# EAGLE design TPS54302 (EAGLE 9.5.1)
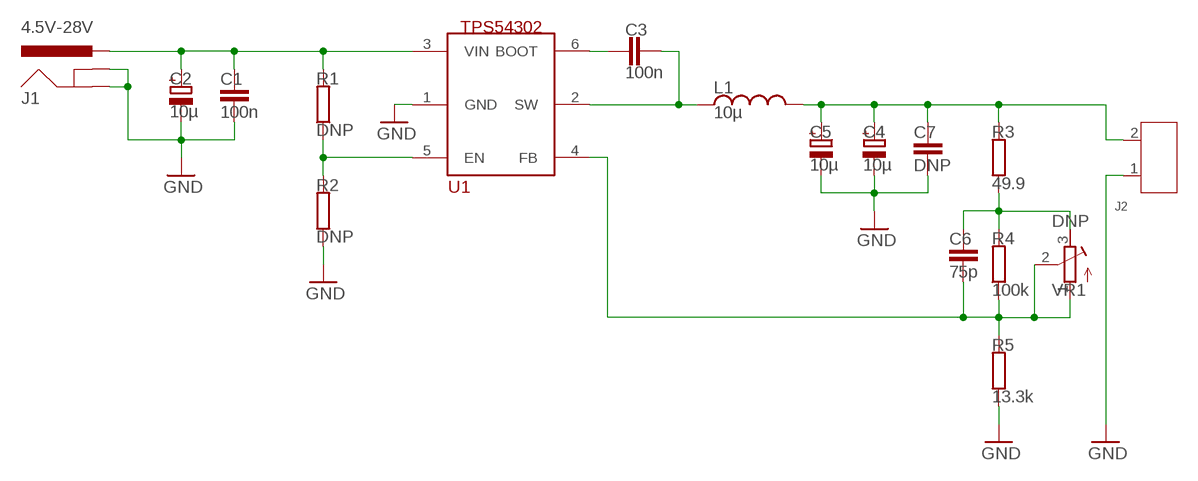
[diagram p0: schematic, sheet 1]

## Parts
C1  100n  C-EUC0603K  [C0603K]
C2  10µ  CPOL-EU153CLV-0605  [153CLV-0605]
C3  100n  C-EUC0603K  [C0603K]
C4  10µ  CPOL-EU153CLV-0605  [153CLV-0605]
C5  10µ  CPOL-EU153CLV-0605  [153CLV-0605]
C6  75p  C-EUC0603K  [C0603K]
C7  DNP  C-EUC0603K  [C0603K]
J1  4.5V-28V  POWER_JACKPTH_SMD_COMBO  [POWER_JACK_COMBO]
J2  SCREW-TERMINAL-GREEN(2P-5.0)  [H2-5.0-10.5X8.0MM]
L1  10µ  INDUCTOR8080  [INDDFN800X800X420-2N]
R1  DNP  R-EU_R0603  [R0603]
R2  DNP  R-EU_R0603  [R0603]
R3  49.9  R-EU_R0603  [R0603]
R4  100k  R-EU_R0603  [R0603]
R5  13.3k  R-EU_R0603  [R0603]
U1  TPS54302  [SOT95P280X110-6N]
VR1  DNP  R-TRIMM64W  [RTRIM64W]

## Nets
BOOT: C3.1 U1.6(BOOT)
EN: R1.1 R2.2 U1.5(EN)
FB: C6.1 R4.1 R5.2 U1.4(FB) VR1.1(A) VR1.2(S)
GND: C1.2 C2.- C4.- C5.- C7.2 J1.GND(GNDBREAK) J1.GND@1(GND) J1.GND@3(GND) J1.GND@4(GND) J2.1 R2.1 R5.1 U1.1(GND)
N$5: C6.2 R3.1 R4.2 VR1.3(E)
SW: C3.2 L1.1 U1.2(SW)
VIN: C1.1 C2.+ J1.POWER(PWR) J1.POWER@1(PWR) J1.POWER@2(PWR) R1.2 U1.3(VIN)
VOUT: C4.+ C5.+ C7.1 J2.2 L1.2 R3.2

## Library data of the parts
C1 C3 C6 C7 = rcl:C-EU: CAPACITOR, European symbol; SPICEPREFIX: C
C2 C4 C5 = rcl:CPOL-EU: POLARIZED CAPACITOR, European symbol; SPICEPREFIX: C
J1 = DC-Converters:POWER_JACK: Power Jack Connector This is the standard 5.5mm barrel jack for power. The PTH is the most common, proven, reliable, footprint. The Slot footprint only works if the mill layer is transmitted to the PCB fab house so be warned. Here are the connectors we sell at SparkFun: DC Barrel Power Jack/Connector <https://www.sparkfun.com/products/119> (PRT-00119) DC Barrel Power Jack/Connector (SMD) <https://www.sparkfun.com/products/12748> (PRT-12748) DC Barrel Jack Adapter - Breadboard Compatible <https://www.sparkfun.com/products/10811> (PRT-10811) It is used on this SparkFun product (and many, many others): SparkFun RedBoard - Programmed with Arduino <https://www.sparkfun.com/products/12757> (DEV-12757) Also, if you need a mating power supply or connector, please check these out: Wall Adapter Power Supply - 9VDC 650mA <https://www.sparkfun.com/products/298> (TOL-00298) DC Barrel Jack Adapter - Male <https://www.sparkfun.com/products/10287> (PRT-10287)
J2 = Seeed-OPL-Connector:SCREW-TERMINAL-GREEN(2P-5.0): 320110031; VALUE: GREEN-2P-5.0
L1 = DC-Converters:INDUCTOR
R1-R5 = rcl:R-EU_: RESISTOR, European symbol; SPICEPREFIX: R
U1 = DC-Converters:TPS54302
VR1 = rcl:R-TRIMM: Trimm resistor; SPICEMODEL: X; SPICEPREFIXL: POT

## Board
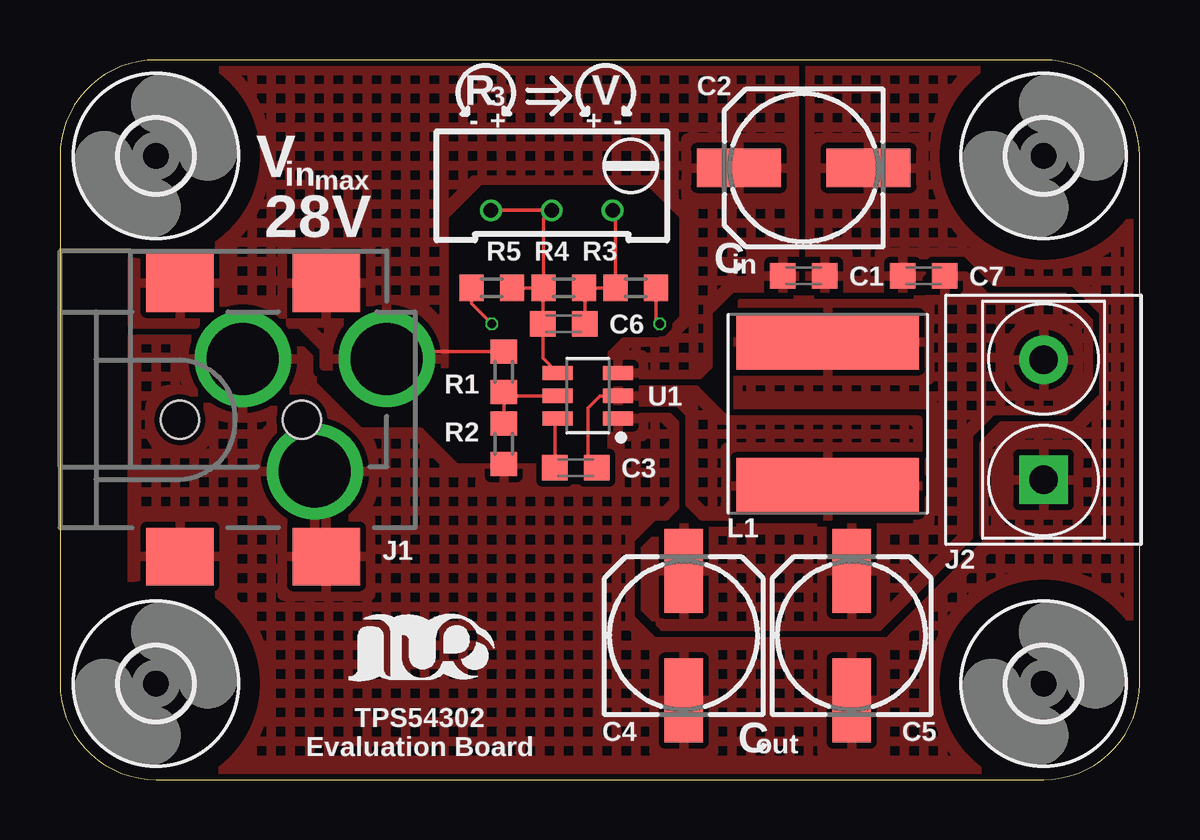
[diagram p1: board, top side]
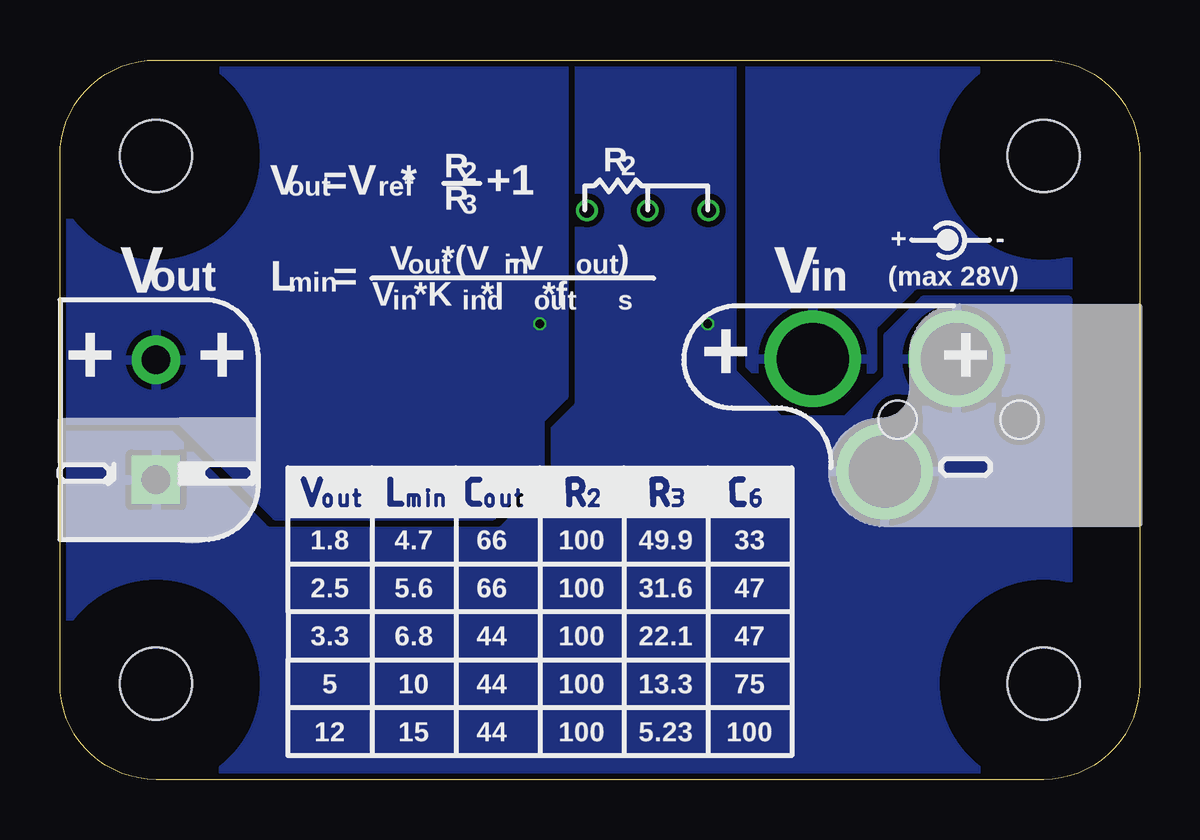
[diagram p2: board, bottom side, seen from below]

Size 45 x 30 mm. Coordinates in mm from the lower left corner, seen from the top.
Outline: 45,4 45,26 arc90 41,30 4,30 arc90 0,26 0,4 arc90 4,0 41,0 arc90 45,4
Copper layers (1*16): Top 0.035mm / dielectric 1.5mm / Bottom 0.035mm
Design rules "JLCPCB-2Layer-Tented": minimum track width 5mil, minimum drill 0.3mm, track to track 5mil, track to pad 5mil, pad to pad 5mil, via to via 5mil, smd to smd 5mil, copper to edge 0.2mm, drill to drill 5mil, minimum pad ring 3mil, minimum via ring 3mil, stop-mask expansion 4mil, vias tented up to drill 50mil, thermal gap 10mil

### Footprints (pad centres in the part's own frame; a part is rotated, then mirrored left to right if it is on the bottom)
C0603K = smd 1.05 x 1.08: 1 -0.875,0; 2 0.875,0
153CLV-0605 = smd 3.5 x 1.6: + 2.7,0; - -2.7,0
POWER_JACK_COMBO = drill 2.997: GND 5.62,-2.16; GND@1 2.62,2.54; POWER 8.62,2.54 | smd 2.8 x 2.4: GND@3 0,-5.7; GND@4 6.1,-5.7; POWER@1 0,5.7; POWER@2 6.1,5.7 | hole 1.6: 0,0; 5.08,0
H2-5.0-10.5X8.0MM = drill 1.168 pad 2.032 square: 1 0,2.5 | drill 1.168 pad 2.032: 2 0,-2.5
INDDFN800X800X420-2N = smd 2.312 x 7.612: 1 -3,0; 2 3,0
R0603 = smd 1 x 1.1: 1 -0.85,0; 2 0.85,0
SOT95P280X110-6N = smd 1.25 x 0.589: 1 -1.256,0.95; 2 -1.256,0; 3 -1.256,-0.95; 4 1.256,-0.95; 5 1.256,0; 6 1.256,0.95
3,0 = hole 3: 0,0
RTRIM64W = drill 0.61: 1 1.27,-2.54; 2 1.27,0; 3 1.27,2.54

### Placement (x,y rotation side)
C1  31,21 0 top
C2  31,25.5 180 top
C3  21.5,13 0 top
C4  26,6 90 top
C5  33,6 90 top
C6  21,19 0 top
C7  36,21 180 top
J1  5,15 0 top
J2  41,15 180 top
L1  32,15.25 90 top
R1  18.5,17 90 top
R2  18.5,14 90 top
R3  24,20.5 0 top
R4  21,20.5 0 top
R5  18,20.5 0 top
U1  22,16 180 top
U$1  [3,0]  4,4 0 top
U$2  [3,0]  4,26 0 top
U$3  [3,0]  41,4 0 top
U$4  [3,0]  41,26 0 top
U$5  [LOGO-SILKSCREEEN-S]  15,5 0 top
VR1  20.5,25 270 top

### Tracks (layer width: path | path; a pad name or v marks a point on that pad's centre or on a via)
BOOT
  Top 0.152: U1.6 20.62,14.93 C3.1
EN
  Top 0.152: U1.5 18.65,16 R1.1 R2.2
FB
  Top 0.152: R4.1 R5.2 | R4.1 20.12,20.48 C6.1 20.12,17.57 U1.4 | VR1.1 VR1.2 20.15,23.38 R4.1
GND  (via drill 0.35)
  Top 0.152: R5.1 17.15,19.85 v18,19
  pour Top (isolate 0.25, rank 5, hatched): 15,14.5 12.5,14.5 10.5,16.5 10.5,17.5 9.5,18.5 3,18.5 3,0 41,0 arc90 45,4 45,14.5 40,14.5 39,13.5 39,10.25 34.5,5.75 24.75,5.75 23.75,6.75 23.75,10 24.75,11 25.25,11 25.75,11.5 25.75,15.75 23,15.75 23,14 22,13 16.5,13
  pour Top (isolate 0.25, hatched): 31.25,30 41,30 arc-90 45,26 45,10.25 38.5,10.25 38.5,14 39.25,14.75 42.25,14.75 43.5,16 43.5,19.5 42.25,20.75 39,20.75 37.75,22 36.75,22 35.75,21 35.75,20.5 31.25,20.5
  pour Bottom (isolate 0.25, rank 3): 3,20 9,20 10.5,18.5 10.5,16.75 12.25,15 15,15 17,17 17,29.75 24,29.75 24,16 25,15 25,13 27,11 36,11 40,15 45,15 45,0 3,0
N$5
  Top 0.152: C6.2 21.88,20.48 R4.2 R3.1 23.15,23.62 VR1.3
SW
  Top 0.152: C3.2 22,13.38 22,15.5 22.5,16 U1.2
  pour Top (isolate 0.25, hatched): 23,15.75 23,16.25 26.5,16.25 27.75,15 35.75,15 35.75,11 26.75,11 26.25,11.5 26.25,15.25 25.75,15.75
VIN
  Top 0.152: R1.2 13.93,17.85 J1.POWER
  pour Top (isolate 0.25, rank 2, hatched): 11,17.25 11,18 10,19 3,19 3,30 30.75,30 30.75,20.5 28,20.5 27,19.5 27,17.25 26.5,16.75 23,16.75 23,17.75 23.5,18.25 25,18.25 26,19.25 26,23.5 24.5,25 17.5,25 16,23.5 16,17.25
  pour Bottom (isolate 0.25, rank 4): 3,20 3,30 16.25,30 16.25,17 15.5,16.25 11.75,16.25 10.5,17.5 10.5,18.5 9,20
VOUT  (via drill 0.35)
  Top 0.152: v25,19 24.85,19.15 R3.2
  pour Top (isolate 0.25, rank 6, hatched): 36.25,21.75 36.25,20 28.25,20 28.25,15.5 35.75,15.5 35.75,10.5 25,10.5 24.25,9.75 24.25,7 25,6.25 34.25,6.25 38,10 38,14.25 39,15.25 42,15.25 43,16.25 43,19.25 42,20.25 39,20.25 38,21.25 38,21.75
  pour Bottom (isolate 0.25): 45,15 40,15 36,11 27,11 25,13 25,15 24,16 24,29.75 41,29.75 arc-90 45,25.75

### Text on the board
tPlace: TPS54302 / Evaluation Board
tNames: R | V | - | + | 3 | + | - | V | in | max | 28V | C | in | C | out
bNames: 2 | R | R | +1 | 2 | ref | out | V =V * | 3 | R | - | + | ) | out | in | out | V *(V -V | (max 28V) | in | V | min | L = | out | V | s | out | ind | in | V *K *I *f | + | + | + | + | 33 | 49.9 | 100 | 66 | 4.7 | 1.8 | 47 | 31.6 | 100 | 66 | 5.6 | 2.5 | 47 | 22.1 | 100 | 44 | 6.8 | 3.3 | 75 | 13.3 | 100 | 44 | 10 | 5 | 100 | 5.23 | 100 | 44 | 15 | 12